# Altium schematic sheet COMMUNICATION.SchDoc
size A4; SheetNumber: 3; SheetTotal: 4
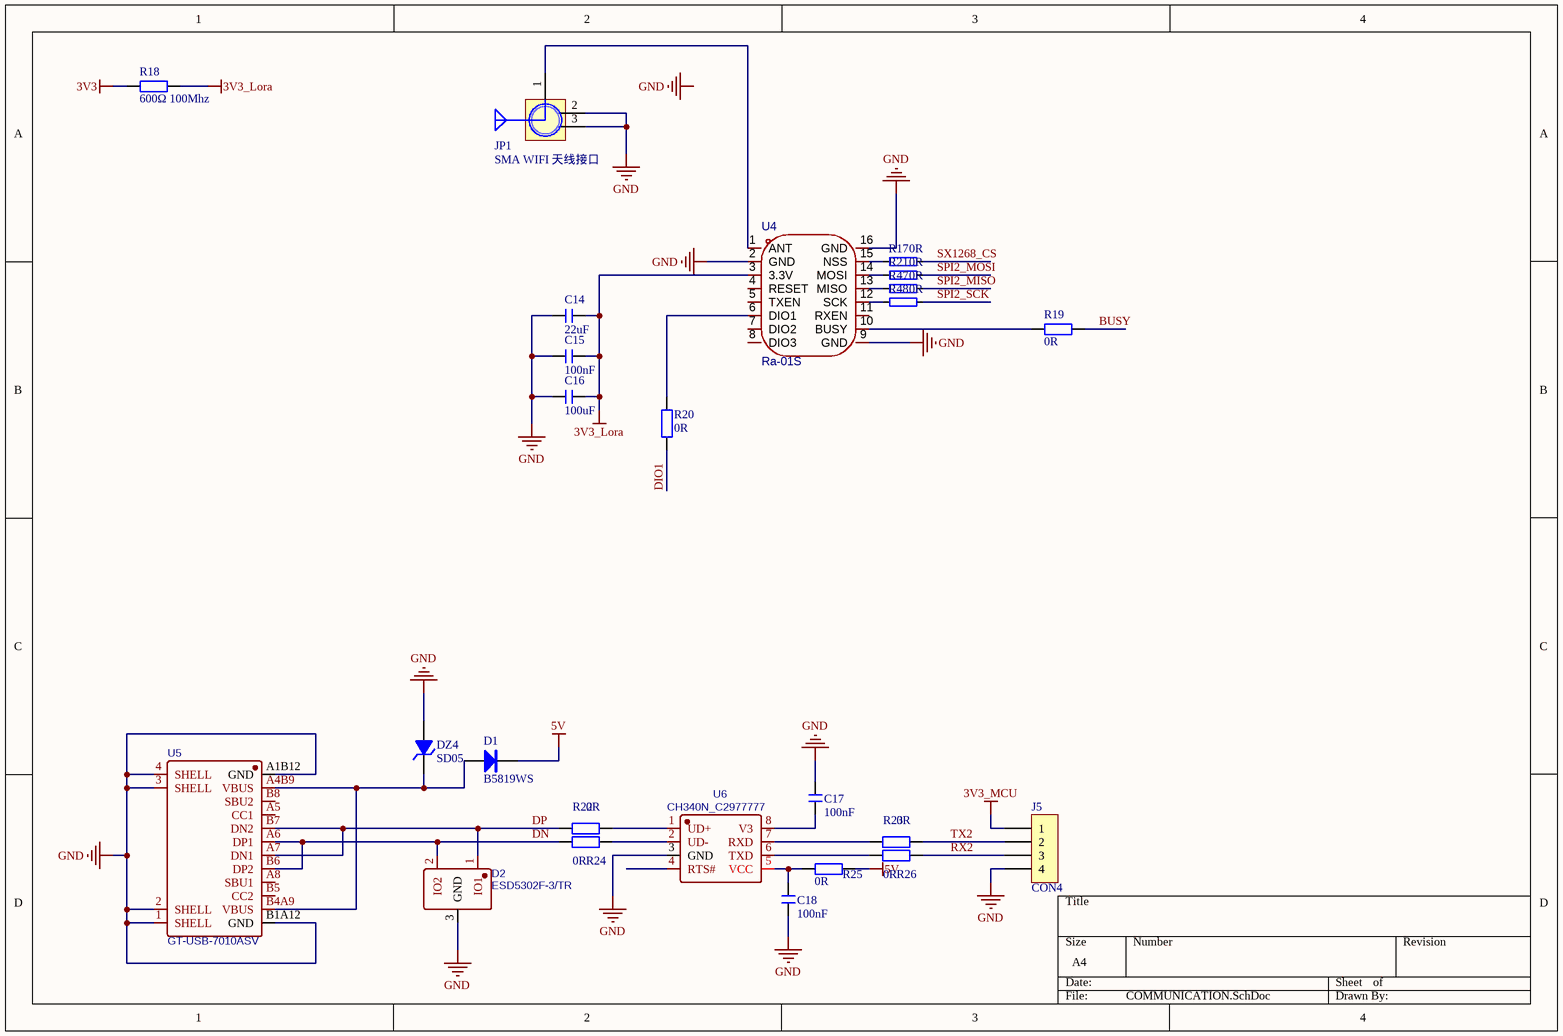
[diagram p0: COMMUNICATION.SchDoc]

## Parts
C14  22uF  [C 0805_L]
C15  100nF  [C 0603_L]
C16  100uF  [C 0603_L]
C17  100nF  [C 0603_L]
C18  100nF  [C 0603_L]
D1  B5819WS  [SOD-323]
D2  ESD5302F-3/TR  [SOT-23]
DZ4  SD05  [SOD-323]
J5  CON4  [HDR2.54-LI-4P]
JP1  SMA WIFI 天线接口  [SMA-KE]
R17  0R  [R 0603_L]
R18  600Ω 100Mhz  [R 0805_L]
R19  0R  [R 0603_L]
R20  0R  [R 0603_L]
R21  0R  [R 0603_L]
R22  0R  [R 0603_L]
R23  0R  [R 0603_L]
R24  0R  [R 0603_L]
R25  0R  [R 0603_L]
R26  0R  [R 0603_L]
R47  0R  [R 0603_L]
R48  0R  [R 0603_L]
U4  Ra-01S  [RA-01SCH-P-TJFZ]
U5  GT-USB-7010ASV  [USB-C-SMD_G-SWITCH_GT-USB-7010ASV]
U6  CH340N_C2977777  [SOP8]

## Nets
3V3: R18.1
3V3_Lora: C14.2 C15.2 C16.2 R18.2 U4.3(3.3V)
3V3_MCU: J5.1
5V: D1.2(K) R25.2
GND: C14.1 C15.1 C16.1 C17.1 C18.2 D2.3(GND) DZ4.1(A) J5.4 JP1.2(GND) JP1.3(GND) U4.2(GND) U4.9(GND) U4.16(GND) U5.1(SHELL) U5.2(SHELL) U5.3(SHELL) U5.4(SHELL) U5.A1B12(GND) U5.B1A12(GND) U6.3(GND)
BUSY: R19.1
DIO1: R20.1
DN: D2.2(IO2) R24.1 U5.A6(DP1) U5.B6(DP2)
DP: D2.1(IO1) R22.1 U5.A7(DN1) U5.B7(DN2)
RX2: J5.3 R26.2
SPI2_MISO: R47.1
SPI2_MOSI: R21.1
SPI2_SCK: R48.1
SX1268_CS: R17.1
TX2: J5.2 R23.2
NetC17_2: C17.2 U6.8(V3)
NetC18_1: C18.1 R25.1 U6.5(VCC)
NetD1_1: D1.1(A) DZ4.2(K) U5.A4B9(VBUS) U5.B4A9(VBUS)
NetJP1_1: JP1.1(ANT) U4.1(ANT)
NetR17_2: R17.2 U4.15(NSS)
NetR19_2: R19.2 U4.10(BUSY)
NetR20_2: R20.2 U4.6(DIO1)
NetR21_2: R21.2 U4.14(MOSI)
NetR22_2: R22.2 U6.1(UD+)
NetR23_1: R23.1 U6.7(RXD)
NetR24_2: R24.2 U6.2(UD-)
NetR26_1: R26.1 U6.6(TXD)
NetR47_2: R47.2 U4.13(MISO)
NetR48_2: R48.2 U4.12(SCK)

Not connected (* = marked no-connect by the designer): U4 4(RESET) 5(TXEN) 7(DIO2) 8(DIO3) 11(RXEN); U5 A5(CC1) A8(SBU1) B5(CC2) B8(SBU2); U6 4(RTS#)

## Notes on the sheet
- Labels drawn without touching a wire or pin: GND

## Library data of the parts
C14-C18 = C: 无极性贴片电容; 版权归属: 源创客; BOM名称: 无极性贴片电容; 学习资源: www.ooocke.com
D1 = SR540: 肖特基二极管                           电压:40V 电流:1A                 C7420331; BOM名称: 整流二极管; 版权归属: 源创客; 属性: 40V  5A; 学习资源: www.ooocke.com
D2 = ESD5302F-3/TR: 单向TVS 5V截止 峰值浪涌电流：4A@8/20us                        C239643; Manufacturer: WILLSEMI(韦尔); Contributor: LCSC; Supplier: LCSC; Supplier Part: C239643; Manufacturer Part: ESD5302F-3/TR; JLCPCB Part Class: Extended Part; spicePre: D; spiceSymbolName: ESD5302F-3/TR
DZ4 = 1N4106: 单向TVS 5V截止 峰值脉冲电流：17A              C502527; BOM名称: 12V/0.5W稳压管; 版权归属: 源创客; 学习资源: www.ooocke.com
J5 = CON4: Connector
JP1 = SMA: SMA-2.4G射频天线接口; 版权归属: 源创客; BOM名称: SMA-2.4G射频天线接口; 学习资源: www.ooocke.com
R17 R21 R47 R48 = 普通电阻
R18 = R: 磁珠; BOM名称: 贴片电阻; 版权归属: 源创客; 学习资源: www.ooocke.com
R19 R20 R22-R26 = R: 贴片电阻; 版权归属: 源创客; BOM名称: 贴片电阻; 学习资源: www.ooocke.com
U4 = Ra-01S: 发射功率:22dBm;接口类型:SPI;接收灵敏度:-140dBm;; Manufacturer: Ai-Thinker(安信可); AddInBom: yes; ModelId: bfb9ea955ff445c193018999188b6f80聨0819f05c4eef4c71ace90d822a990e87; ModelName: COMM-SMD_L17.0-W16.0-H3.2-RA-01S; ModelTransform: 629.92,669.29,0,0,0,0,0.001,0,0; Output Power: 22dBm; Interface Type: SPI; Modulation System: LoRa；OOK；MSK；GFSK；FSK；GMSK; Voltage - Supply: 3.3V; Antenna Type: IPEX接口; Receive  Current: 4.5mA; Send  Current: 140mA; Symbol: RA-01S; Device: Ra-01S; LCSC Part Name: 两件套 LoRa 系列模块 两件套; SupplierPart: C724871; ManufacturerPart: Ra-01S; Supplier Footprint: SMD,17x16mm; JLCPCB Part Class: Extended Part; Datasheet: https://item.szlcsc.com/datasheet/Ra-01S/770920.html; Supplier: LCSC; ConvertToPcb: yes; FootprintName: COMM-SMD_RA-01S; Sensitivity: -140dBm; Operating Temperature: -40℃~+85℃
U5 = GT-USB-7010ASV: Type-C 母 卧贴                板上16pin，有柱无弹，L7.35 CH1.68mm，3A电流                         C2988369; Manufacturer: G-Switch(品赞); Contributor: lcsc; Supplier: LCSC; Supplier Part: C2988369; Manufacturer Part: GT-USB-7010ASV; JLCPCB Part Class: Extended Part; spicePre: U; spiceSymbolName: GT-USB-7010ASV
U6 = CH340N_C2977777: Manufacturer: WCH(南京沁恒); Manufacturer Part: CH340N; Contributor: LCSC; Supplier: LCSC; Supplier Part: C2977777; JLCPCB Part Class: Extended Part; spicePre: U; spiceSymbolName: CH340N_C2977777